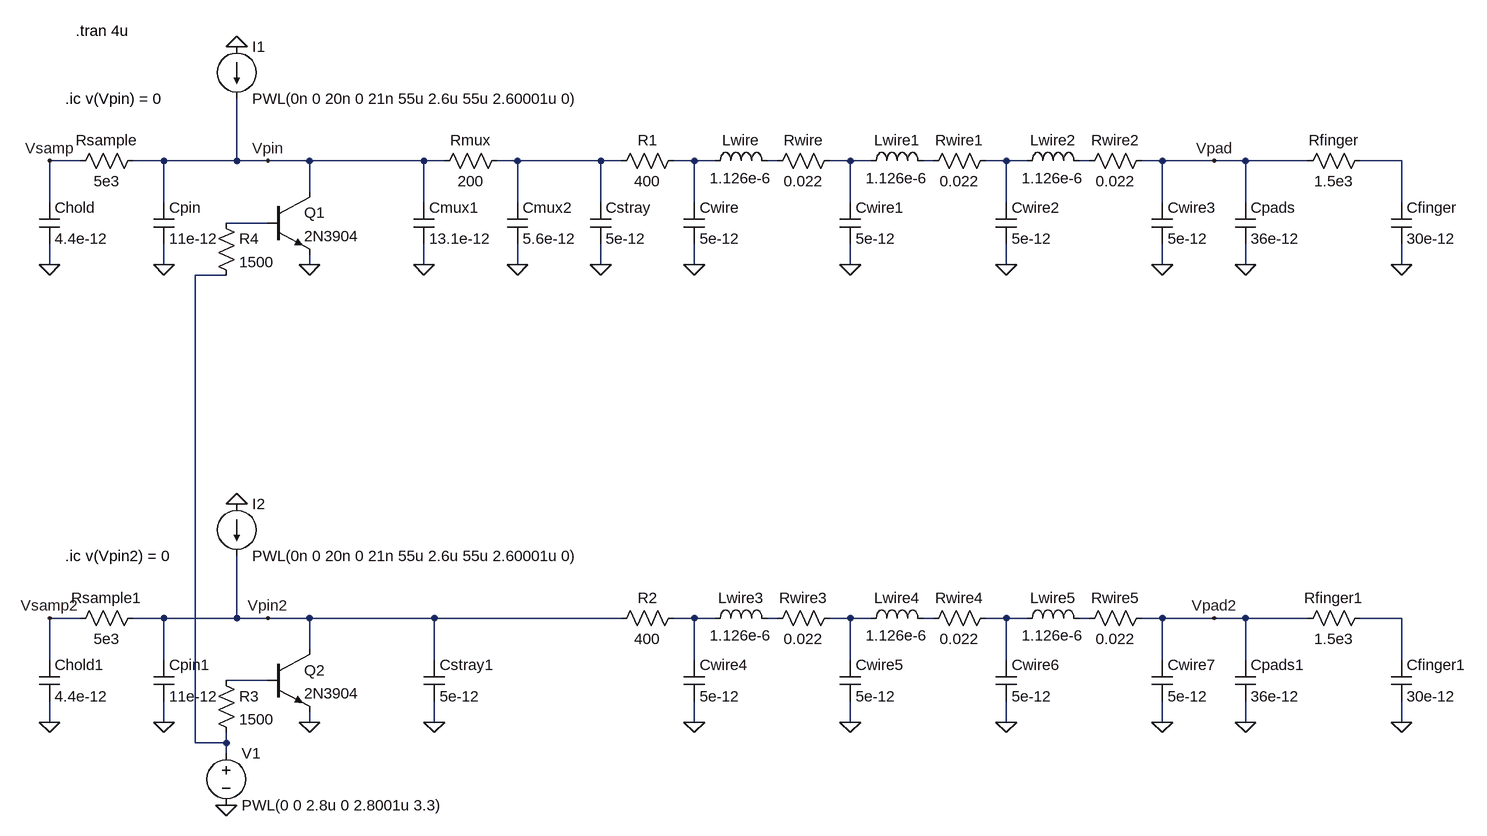
[diagram p0: schematic TouchInput.asc]
TouchInput.asc, the LTspice schematic file:
Version 4
SHEET 1 2296 900
WIRE 96 -192 48 -192
WIRE 224 -192 176 -192
WIRE 336 -192 336 -288
WIRE 336 -192 224 -192
WIRE 384 -192 336 -192
WIRE 448 -192 384 -192
WIRE 624 -192 448 -192
WIRE 656 -192 624 -192
WIRE 768 -192 736 -192
WIRE 896 -192 768 -192
WIRE 928 -192 896 -192
WIRE 1040 -192 1008 -192
WIRE 1072 -192 1040 -192
WIRE 1168 -192 1152 -192
WIRE 1280 -192 1248 -192
WIRE 1312 -192 1280 -192
WIRE 1408 -192 1392 -192
WIRE 1520 -192 1488 -192
WIRE 1552 -192 1520 -192
WIRE 1648 -192 1632 -192
WIRE 1760 -192 1728 -192
WIRE 1840 -192 1760 -192
WIRE 1888 -192 1840 -192
WIRE 1984 -192 1888 -192
WIRE 2128 -192 2064 -192
WIRE 448 -144 448 -192
WIRE 48 -128 48 -192
WIRE 224 -128 224 -192
WIRE 624 -128 624 -192
WIRE 768 -128 768 -192
WIRE 896 -128 896 -192
WIRE 1040 -128 1040 -192
WIRE 1280 -128 1280 -192
WIRE 1520 -128 1520 -192
WIRE 1760 -128 1760 -192
WIRE 1888 -128 1888 -192
WIRE 2128 -128 2128 -192
WIRE 384 -96 320 -96
WIRE 48 -32 48 -64
WIRE 224 -32 224 -64
WIRE 448 -32 448 -48
WIRE 624 -32 624 -64
WIRE 768 -32 768 -64
WIRE 896 -32 896 -64
WIRE 1040 -32 1040 -64
WIRE 1280 -32 1280 -64
WIRE 1520 -32 1520 -64
WIRE 1760 -32 1760 -64
WIRE 1888 -32 1888 -64
WIRE 2128 -32 2128 -64
WIRE 320 -16 272 -16
WIRE 96 512 48 512
WIRE 224 512 176 512
WIRE 336 512 336 416
WIRE 336 512 224 512
WIRE 384 512 336 512
WIRE 448 512 384 512
WIRE 640 512 448 512
WIRE 928 512 640 512
WIRE 1040 512 1008 512
WIRE 1072 512 1040 512
WIRE 1168 512 1152 512
WIRE 1280 512 1248 512
WIRE 1312 512 1280 512
WIRE 1408 512 1392 512
WIRE 1520 512 1488 512
WIRE 1552 512 1520 512
WIRE 1648 512 1632 512
WIRE 1760 512 1728 512
WIRE 1840 512 1760 512
WIRE 1888 512 1840 512
WIRE 1984 512 1888 512
WIRE 2128 512 2064 512
WIRE 448 560 448 512
WIRE 48 576 48 512
WIRE 224 576 224 512
WIRE 640 576 640 512
WIRE 1040 576 1040 512
WIRE 1280 576 1280 512
WIRE 1520 576 1520 512
WIRE 1760 576 1760 512
WIRE 1888 576 1888 512
WIRE 2128 576 2128 512
WIRE 384 608 320 608
WIRE 48 672 48 640
WIRE 224 672 224 640
WIRE 448 672 448 656
WIRE 640 672 640 640
WIRE 1040 672 1040 640
WIRE 1280 672 1280 640
WIRE 1520 672 1520 640
WIRE 1760 672 1760 640
WIRE 1888 672 1888 640
WIRE 2128 672 2128 640
WIRE 272 704 272 -16
WIRE 320 704 320 688
WIRE 320 704 272 704
WIRE 320 720 320 704
FLAG 48 -32 0
FLAG 224 -32 0
FLAG 624 -32 0
FLAG 768 -32 0
FLAG 1040 -32 0
FLAG 1280 -32 0
FLAG 1520 -32 0
FLAG 1760 -32 0
FLAG 1888 -32 0
FLAG 2128 -32 0
FLAG 336 -368 0
FLAG 384 -192 Vpin
FLAG 1840 -192 Vpad
FLAG 48 672 0
FLAG 224 672 0
FLAG 1040 672 0
FLAG 1280 672 0
FLAG 1520 672 0
FLAG 1760 672 0
FLAG 1888 672 0
FLAG 2128 672 0
FLAG 336 336 0
FLAG 384 512 Vpin2
FLAG 1840 512 Vpad2
FLAG 896 -32 0
FLAG 640 672 0
FLAG 48 -192 Vsamp
FLAG 48 512 Vsamp2
FLAG 448 -32 0
FLAG 448 672 0
FLAG 320 800 0
SYMBOL cap 32 -128 R0
SYMATTR InstName Chold
SYMATTR Value 4.4e-12
SYMBOL cap 208 -128 R0
SYMATTR InstName Cpin
SYMATTR Value 11e-12
SYMBOL res 192 -208 R90
WINDOW 0 0 56 VBottom 2
WINDOW 3 32 56 VTop 2
SYMATTR InstName Rsample
SYMATTR Value 5e3
SYMBOL cap 608 -128 R0
SYMATTR InstName Cmux1
SYMATTR Value 13.1e-12
SYMBOL cap 752 -128 R0
SYMATTR InstName Cmux2
SYMATTR Value 5.6e-12
SYMBOL res 752 -208 R90
WINDOW 0 0 56 VBottom 2
WINDOW 3 32 56 VTop 2
SYMATTR InstName Rmux
SYMATTR Value 200
SYMBOL ind 1056 -176 R270
WINDOW 0 32 56 VTop 2
WINDOW 3 5 56 VBottom 2
SYMATTR InstName Lwire
SYMATTR Value 1.126e-6
SYMBOL res 1264 -208 R90
WINDOW 0 0 56 VBottom 2
WINDOW 3 32 56 VTop 2
SYMATTR InstName Rwire
SYMATTR Value 0.022
SYMBOL cap 1024 -128 R0
SYMATTR InstName Cwire
SYMATTR Value 5e-12
SYMBOL ind 1296 -176 R270
WINDOW 0 32 56 VTop 2
WINDOW 3 5 56 VBottom 2
SYMATTR InstName Lwire1
SYMATTR Value 1.126e-6
SYMBOL res 1504 -208 R90
WINDOW 0 0 56 VBottom 2
WINDOW 3 32 56 VTop 2
SYMATTR InstName Rwire1
SYMATTR Value 0.022
SYMBOL cap 1264 -128 R0
SYMATTR InstName Cwire1
SYMATTR Value 5e-12
SYMBOL ind 1536 -176 R270
WINDOW 0 32 56 VTop 2
WINDOW 3 5 56 VBottom 2
SYMATTR InstName Lwire2
SYMATTR Value 1.126e-6
SYMBOL res 1744 -208 R90
WINDOW 0 0 56 VBottom 2
WINDOW 3 32 56 VTop 2
SYMATTR InstName Rwire2
SYMATTR Value 0.022
SYMBOL cap 1504 -128 R0
SYMATTR InstName Cwire2
SYMATTR Value 5e-12
SYMBOL cap 1744 -128 R0
SYMATTR InstName Cwire3
SYMATTR Value 5e-12
SYMBOL cap 1872 -128 R0
SYMATTR InstName Cpads
SYMATTR Value 36e-12
SYMBOL res 2080 -208 R90
WINDOW 0 0 56 VBottom 2
WINDOW 3 32 56 VTop 2
SYMATTR InstName Rfinger
SYMATTR Value 1.5e3
SYMBOL cap 2112 -128 R0
SYMATTR InstName Cfinger
SYMATTR Value 30e-12
SYMBOL current 336 -368 R0
WINDOW 123 0 0 Left 2
WINDOW 39 0 0 Left 2
SYMATTR InstName I1
SYMATTR Value PWL(0n 0 20n 0 21n 55u 2.6u 55u 2.60001u 0)
SYMBOL cap 32 576 R0
SYMATTR InstName Chold1
SYMATTR Value 4.4e-12
SYMBOL cap 208 576 R0
SYMATTR InstName Cpin1
SYMATTR Value 11e-12
SYMBOL res 192 496 R90
WINDOW 0 0 56 VBottom 2
WINDOW 3 32 56 VTop 2
SYMATTR InstName Rsample1
SYMATTR Value 5e3
SYMBOL ind 1056 528 R270
WINDOW 0 32 56 VTop 2
WINDOW 3 5 56 VBottom 2
SYMATTR InstName Lwire3
SYMATTR Value 1.126e-6
SYMBOL res 1264 496 R90
WINDOW 0 0 56 VBottom 2
WINDOW 3 32 56 VTop 2
SYMATTR InstName Rwire3
SYMATTR Value 0.022
SYMBOL cap 1024 576 R0
SYMATTR InstName Cwire4
SYMATTR Value 5e-12
SYMBOL ind 1296 528 R270
WINDOW 0 32 56 VTop 2
WINDOW 3 5 56 VBottom 2
SYMATTR InstName Lwire4
SYMATTR Value 1.126e-6
SYMBOL res 1504 496 R90
WINDOW 0 0 56 VBottom 2
WINDOW 3 32 56 VTop 2
SYMATTR InstName Rwire4
SYMATTR Value 0.022
SYMBOL cap 1264 576 R0
SYMATTR InstName Cwire5
SYMATTR Value 5e-12
SYMBOL ind 1536 528 R270
WINDOW 0 32 56 VTop 2
WINDOW 3 5 56 VBottom 2
SYMATTR InstName Lwire5
SYMATTR Value 1.126e-6
SYMBOL res 1744 496 R90
WINDOW 0 0 56 VBottom 2
WINDOW 3 32 56 VTop 2
SYMATTR InstName Rwire5
SYMATTR Value 0.022
SYMBOL cap 1504 576 R0
SYMATTR InstName Cwire6
SYMATTR Value 5e-12
SYMBOL cap 1744 576 R0
SYMATTR InstName Cwire7
SYMATTR Value 5e-12
SYMBOL cap 1872 576 R0
SYMATTR InstName Cpads1
SYMATTR Value 36e-12
SYMBOL res 2080 496 R90
WINDOW 0 0 56 VBottom 2
WINDOW 3 32 56 VTop 2
SYMATTR InstName Rfinger1
SYMATTR Value 1.5e3
SYMBOL cap 2112 576 R0
SYMATTR InstName Cfinger1
SYMATTR Value 30e-12
SYMBOL current 336 336 R0
WINDOW 123 0 0 Left 2
WINDOW 39 0 0 Left 2
SYMATTR InstName I2
SYMATTR Value PWL(0n 0 20n 0 21n 55u 2.6u 55u 2.60001u 0)
SYMBOL cap 880 -128 R0
SYMATTR InstName Cstray
SYMATTR Value 5e-12
SYMBOL cap 624 576 R0
SYMATTR InstName Cstray1
SYMATTR Value 5e-12
SYMBOL res 1024 -208 R90
WINDOW 0 0 56 VBottom 2
WINDOW 3 32 56 VTop 2
SYMATTR InstName R1
SYMATTR Value 400
SYMBOL res 1024 496 R90
WINDOW 0 0 56 VBottom 2
WINDOW 3 32 56 VTop 2
SYMATTR InstName R2
SYMATTR Value 400
SYMBOL npn 384 -144 R0
SYMATTR InstName Q1
SYMATTR Value 2N3904
SYMBOL npn 384 560 R0
SYMATTR InstName Q2
SYMATTR Value 2N3904
SYMBOL res 304 592 R0
SYMATTR InstName R3
SYMATTR Value 1500
SYMBOL res 304 -112 R0
SYMATTR InstName R4
SYMATTR Value 1500
SYMBOL voltage 320 704 R0
WINDOW 123 0 0 Left 2
WINDOW 39 0 0 Left 2
SYMATTR InstName V1
SYMATTR Value PWL(0 0 2.8u 0 2.8001u 3.3)
TEXT 88 -392 Left 2 !.tran 4u
TEXT 72 -288 Left 2 !.ic v(Vpin) = 0
TEXT 72 416 Left 2 !.ic v(Vpin2) = 0

The netlist it stands for:
* TouchInput.asc
Chold Vsamp 0 4.4e-12
Cpin Vpin 0 11e-12
Rsample Vpin Vsamp 5e3
Cmux1 Vpin 0 13.1e-12
Cmux2 N001 0 5.6e-12
Rmux N001 Vpin 200
Lwire N002 N003 1.126e-6
Rwire N004 N003 0.022
Cwire N002 0 5e-12
Lwire1 N004 N005 1.126e-6
Rwire1 N006 N005 0.022
Cwire1 N004 0 5e-12
Lwire2 N006 N007 1.126e-6
Rwire2 Vpad N007 0.022
Cwire2 N006 0 5e-12
Cwire3 Vpad 0 5e-12
Cpads Vpad 0 36e-12
Rfinger N008 Vpad 1.5e3
Cfinger N008 0 30e-12
I1 0 Vpin PWL(0n 0 20n 0 21n 55u 2.6u 55u 2.60001u 0)
Chold1 Vsamp2 0 4.4e-12
Cpin1 Vpin2 0 11e-12
Rsample1 Vpin2 Vsamp2 5e3
Lwire3 N011 N012 1.126e-6
Rwire3 N013 N012 0.022
Cwire4 N011 0 5e-12
Lwire4 N013 N014 1.126e-6
Rwire4 N015 N014 0.022
Cwire5 N013 0 5e-12
Lwire5 N015 N016 1.126e-6
Rwire5 Vpad2 N016 0.022
Cwire6 N015 0 5e-12
Cwire7 Vpad2 0 5e-12
Cpads1 Vpad2 0 36e-12
Rfinger1 N017 Vpad2 1.5e3
Cfinger1 N017 0 30e-12
I2 0 Vpin2 PWL(0n 0 20n 0 21n 55u 2.6u 55u 2.60001u 0)
Cstray N001 0 5e-12
Cstray1 Vpin2 0 5e-12
R1 N002 N001 400
R2 N011 Vpin2 400
Q1 Vpin N009 0 0 2N3904
Q2 Vpin2 N018 0 0 2N3904
R3 N018 N010 1500
R4 N009 N010 1500
V1 N010 0 PWL(0 0 2.8u 0 2.8001u 3.3)
.model NPN NPN
.model PNP PNP
.lib standard.bjt
.tran 4u
.ic v(Vpin) = 0
.ic v(Vpin2) = 0
.backanno
.end